# EasyEDA Pro project speedPulser.epro

# Schematic Schematic1
Board Name: Board1; Create Date: 2025-11-09; Page Name: P1; Project Name: SpeedPulserV2; Schematic Name: Schematic1; Update Date: 2025-11-13; Company: EasyEDA.com; Page Size: A4; Version: V1.0
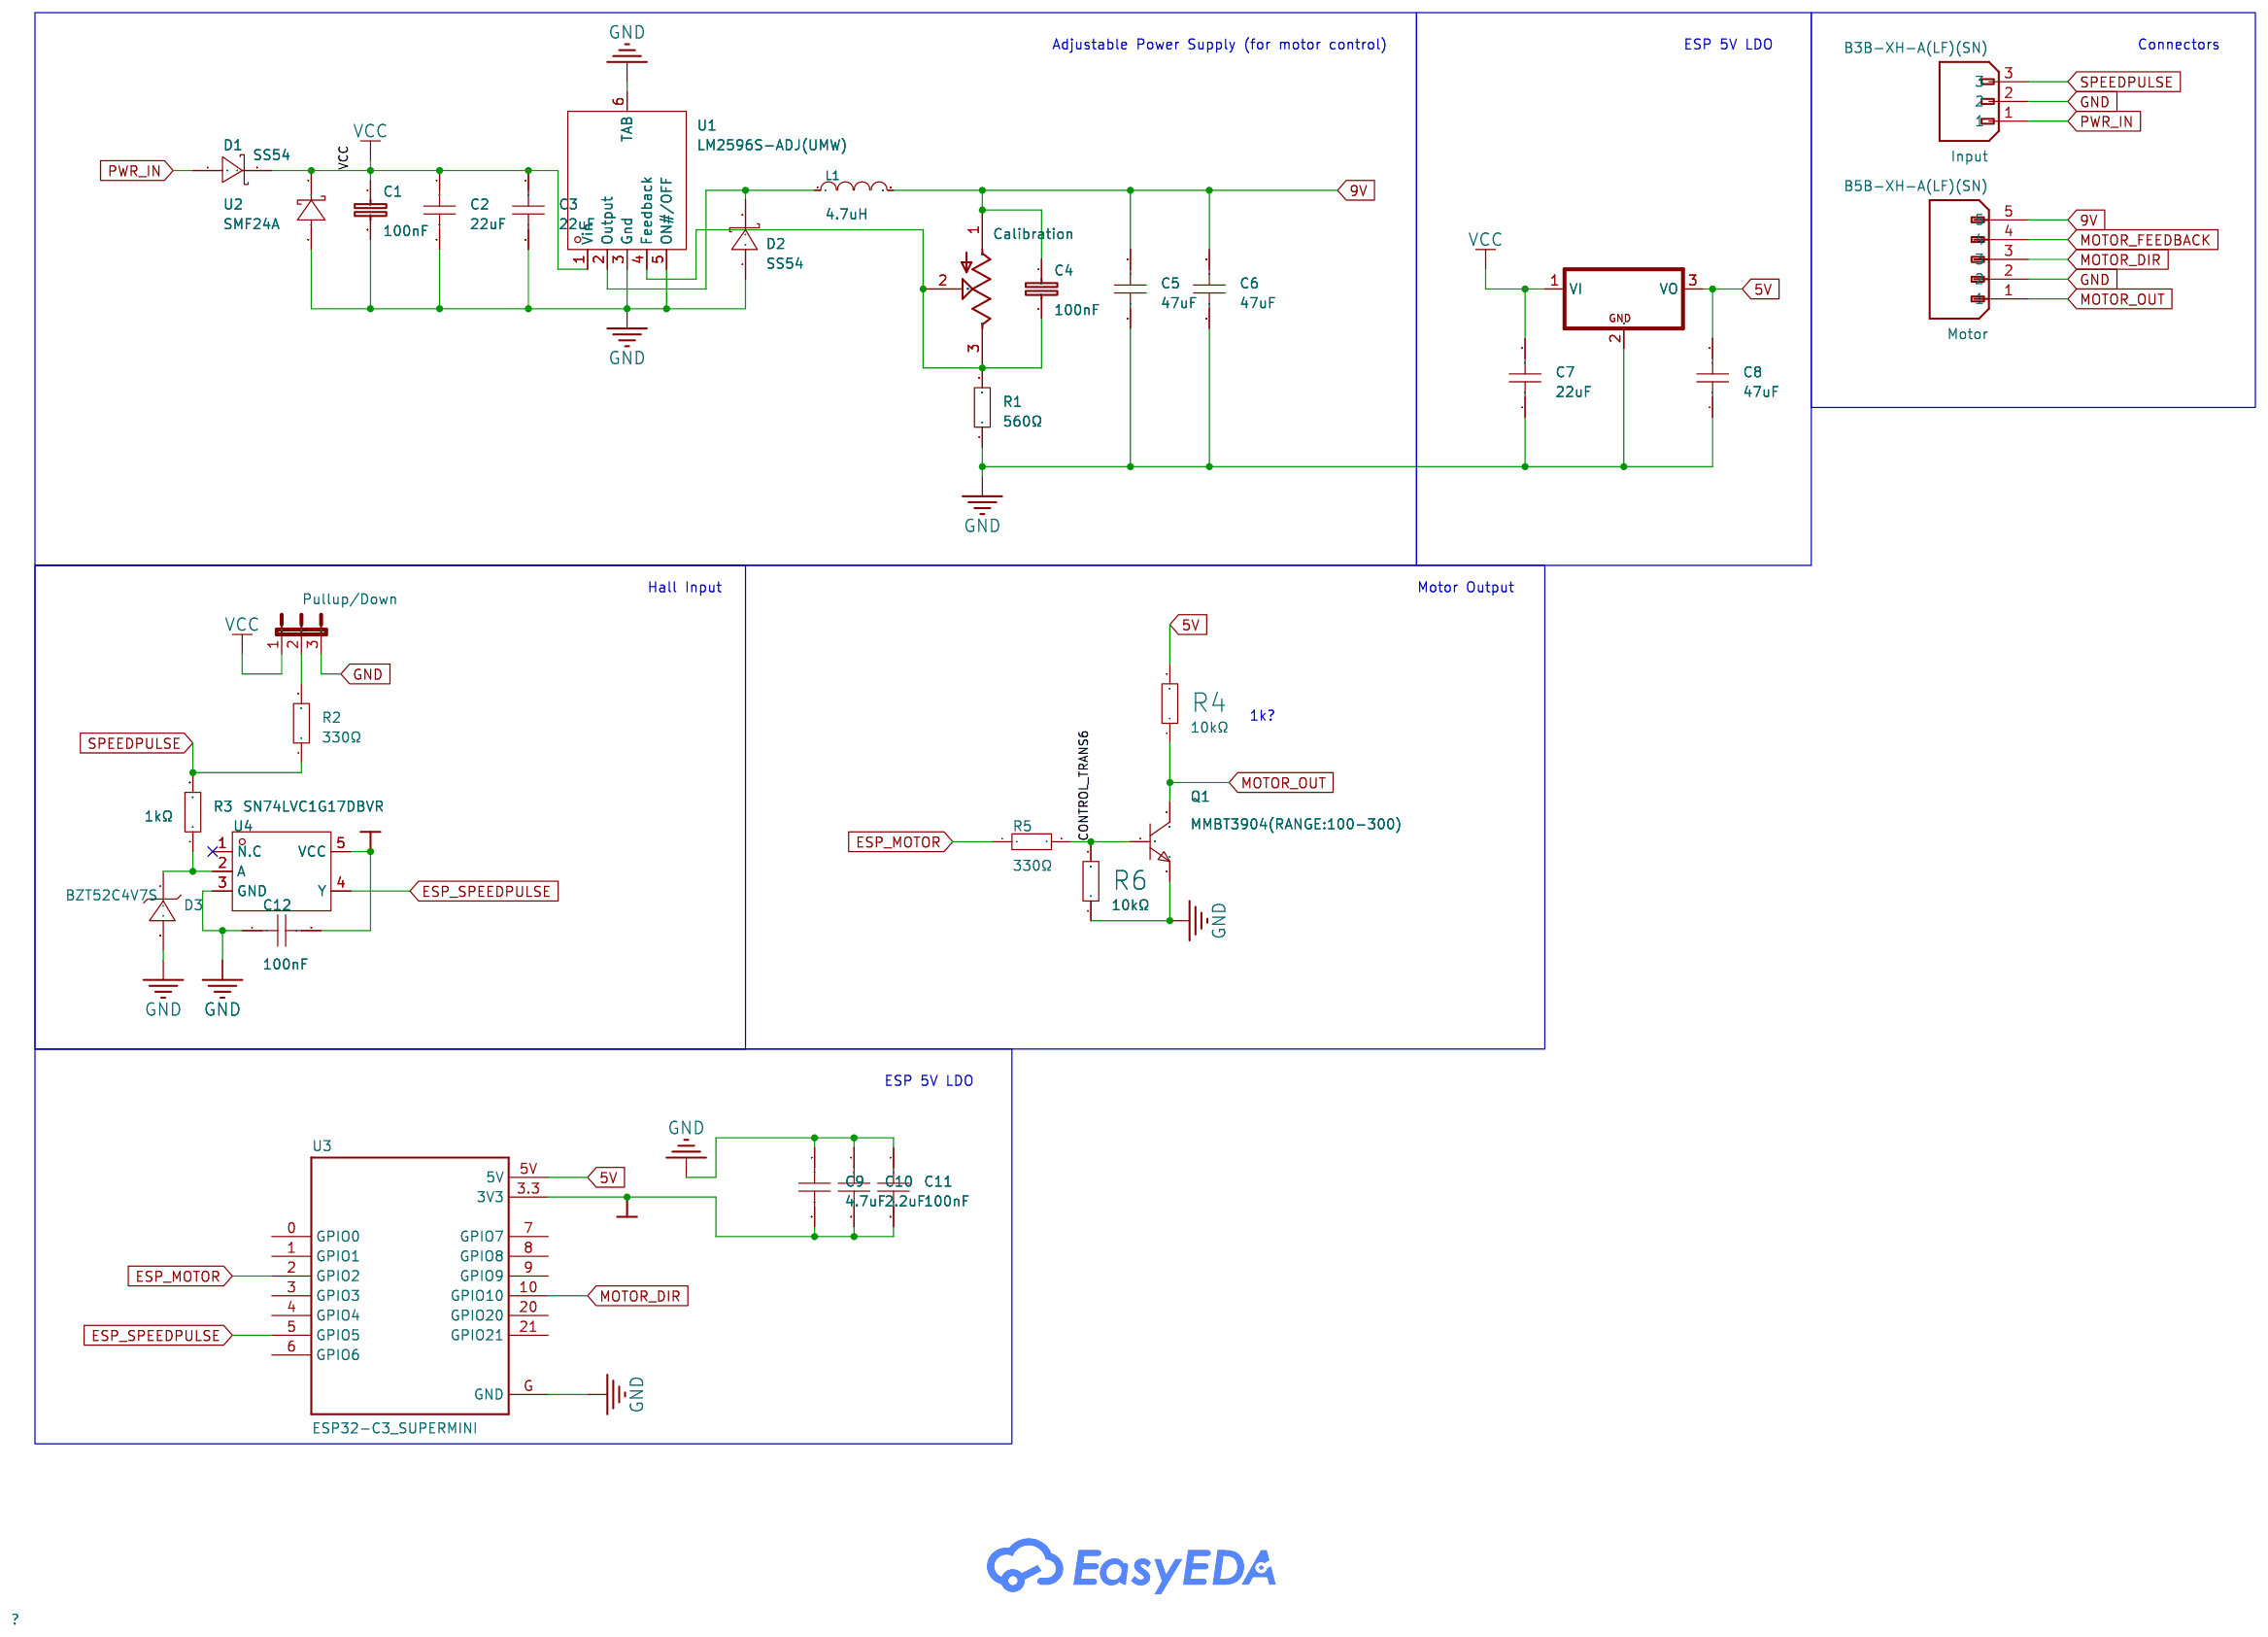
[diagram p0: schematic sheet]

## Parts
C1  100nF  [C0805]
C2  22uF  [C0805]
C3  22uF  [C0805]
C4  100nF  [C0805]
C5  47uF  [C0805]
C6  47uF  [C0805]
C7  22uF  [C0805]
C8  47uF  [C0805]
C9  4.7uF  [C0603]
C10  2.2uF  [C0603]
C11  100nF  [C0603]
C12  100nF  [C0603]
Calibration  10kΩ  [RES-ADJ-TH_3362P]
D1  SS54  [SMA_L4.4-W2.8-LS5.4-R-RD]
D2  SS54  [SMA_L4.4-W2.8-LS5.4-R-RD]
D3  BZT52C4V7S  [SOD-323_L1.8-W1.3-LS2.5-RD]
IC1  L7805ABD2T-TR  [TO-263-2_L10.0-W9.2-P5.08-LS15.3-TL-CW]
Input  B3B-XH-A(LF)(SN)  [CONN-TH_3P-P2.50_A2501WV2-3P]
L1  4.7uH  [IND-SMD_L4.8-W4.5]
Motor  B5B-XH-A(LF)(SN)  [CONN-TH_B5B-XH-A-LF-SN]
Pullup/Down  PZ254V-11-03P  [HDR-TH_3P-P2.54-V-M]
Q1  MMBT3904(RANGE:100-300)  [SOT-23-3_L2.9-W1.3-P1.90-LS2.4-BR]
R1  560Ω  [R0603]
R2  330Ω  [R0603]
R3  1kΩ  [R0603]
R4  10kΩ  [R0603]
R5  330Ω  [R0603]
R6  10kΩ  [R0603]
U1  LM2596S-ADJ(UMW)  [TO-263-5_L10.2-W8.9-P1.70-BR]
U2  SMF24A  [SOD-123FL_L2.8-W1.8-LS3.7-RD-1]
U3  ESP32-C3_SUPERMINI  [MODULE_ESP32-C3_SUPERMINI]
U4  SN74LVC1G17DBVR  [SOT-23-5_L3.0-W1.5-P0.95-LS2.8-BL]

## Library data of the parts
C1 C4 = CT41G-0805-2X1-50V-0.1μF-K(N): Capacitance:100nF Tolerance:±10% Tolerance:±10% Voltage Rating:50V Temperature Coefficient:-; LCSC Part Name: 100nF ±10% 50V; Supplier Part: C126469; Manufacturer: TORCH(火炬); Supplier Footprint: 0805; JLCPCB Part Class: Extended Part; Datasheet: https://atta.szlcsc.com/upload/public/pdf/source/20171225/C150708_15141883600121203188.pdf; Supplier: LCSC; Tolerance: ±10%; Voltage Rating: 50V; Check: true
C2 C3 C7 = HGC0805R5226M350NSLJ: Capacitance: Tolerance:±20% Tolerance:±20% Voltage Rated: Temperature Coefficient:; LCSC Part Name: 22uF ±20% 35V; Supplier Part: C22367832; Manufacturer: Chinocera(华瓷); Supplier Footprint: 0805; JLCPCB Part Class: Extended Part; Datasheet: https://atta.szlcsc.com/upload/public/pdf/source/20240326/E9E9157D170E907C889ABA1F54A94302.pdf; Supplier: LCSC; Tolerance: ±20%; Standardization Check: false
C5 C6 C8 = CL21A476MPYNNWE: Capacitance:47uF Tolerance:±20% Tolerance:±20% Voltage Rating:10V Temperature Coefficient:X5R; LCSC Part Name: 47uF ±20% 10V; Supplier Part: C5596752; Manufacturer: SAMSUNG(三星); Supplier Footprint: 0805; JLCPCB Part Class: Extended Part; Datasheet: https://item.szlcsc.com/datasheet/CL21A476MPYNNWE/6515219.html; Supplier: LCSC; Tolerance: ±20%; Voltage Rating: 10V; Temperature Coefficient: X5R
C9 = CL10A475KP8NNNC: Capacitance:4.7uF Tolerance:±10% Tolerance:±10% Voltage Rating:10V Temperature Coefficient:X5R; LCSC Part Name: 4.7uF ±10% 10V; Supplier Part: C1705; Manufacturer: SAMSUNG(三星); Supplier Footprint: 0603; JLCPCB Part Class: Extended Part; Datasheet: https://item.szlcsc.com/datasheet/CL10A475KP8NNNC/2057.html; Supplier: LCSC; Tolerance: ±10%; Voltage Rating: 10V; Temperature Coefficient: X5R
C10 = CL10A225KO8NNNC: Capacitance:2.2uF Tolerance:±10% Tolerance:±10% Voltage Rating:16V Temperature Coefficient:X5R; LCSC Part Name: 2.2uF ±10% 16V; Supplier Part: C23630; Manufacturer: SAMSUNG(三星); Supplier Footprint: 0603; JLCPCB Part Class: Basic Part; Datasheet: https://item.szlcsc.com/datasheet/CL10A225KO8NNNC/24366.html; Supplier: LCSC; Tolerance: ±10%; Voltage Rating: 16V; Temperature Coefficient: X5R
C11 = CL10B104KB8NNNC: Capacitance:100nF Tolerance:±10% Tolerance:±10% Voltage Rating:50V Temperature Coefficient:X7R; LCSC Part Name: 100nF ±10% 50V; Supplier Part: C1591; Manufacturer: SAMSUNG(三星); Supplier Footprint: 0603; JLCPCB Part Class: Extended Part; Datasheet: https://item.szlcsc.com/datasheet/CL10B104KB8NNNC/1943.html; Supplier: LCSC; Tolerance: ±10%; Voltage Rating: 50V; Temperature Coefficient: X7R
C12 = CC0603KRX7R9BB104: Capacitance:100nF Tolerance:±10% Tolerance:±10% Voltage Rating:50V Temperature Coefficient:X7R; LCSC Part Name: 100nF ±10% 50V; Supplier Part: C14663; Manufacturer: YAGEO(国巨); Supplier Footprint: 0603; JLCPCB Part Class: Basic Part; Datasheet: https://atta.szlcsc.com/upload/public/pdf/source/20250214/096C4C206003071F5D32E5F0D8E7F8DF.pdf; Supplier: LCSC; Tolerance: ±10%; Voltage Rating: 50V; Temperature Coefficient: X7R
Calibration = 3362P-1-103_C118956: Resistance: Tolerance:±10% Tolerance:±10%; LCSC Part Name: 10kΩ ±10%; Supplier Part: C118956; Manufacturer: BOCHEN(博晨); Manufacturer Part: 3362P-1-103; Supplier Footprint: 插件; JLCPCB Part Class: Extended Part; Datasheet: https://atta.szlcsc.com/upload/public/pdf/source/20171114/C118956_15106326650691117445.pdf; Supplier: LCSC; Tolerance: ±10%; Check: true
D1 D2 = SS54_C22452: Diode Configuration:Independent Type Forward Voltage (Vf@If):550mV@5A Reverse Voltage (Vr):40V Rectified Current:5A Reverse Leakage Current (Ir):1mA@40V; LCSC Part Name: 电压:40V 电流:5A; Supplier Part: C22452; Manufacturer: MDD(辰达半导体); Supplier Footprint: SMA(DO-214AC); JLCPCB Part Class: Basic Part; Datasheet: https://atta.szlcsc.com/upload/public/pdf/source/20240710/73DFBB65C1883B895E62D589679033DF.pdf; Supplier: LCSC; Diode Configuration: Independent Type; Forward Voltage (Vf@If): 550mV@5A; Reverse Voltage (Vr): 40V; Rectified Current: 5A; Reverse Leakage Current (Ir): 1mA@40V
D3 = BZT52C4V7S_C353517: Diode Configuration:Independent Zener Voltage(Nom):4.7V Reverse Leakage Current (Ir):3uA@2V Zener Voltage(Range):4.4V~5V Zener Voltage(Range):4.4V~5V Pd - Power Dissipation:200mW Impedance(Zzt):80Ω Operating Junction Temperature Range:-55℃~+150℃ Operating; LCSC Part Name: 独立式 耐压:4.7V 电流:3uA@2V; Supplier Part: C353517; Manufacturer: 晶导微电子; Supplier Footprint: SOD-323; JLCPCB Part Class: Extended Part; Datasheet: https://item.szlcsc.com/datasheet/BZT52C4V7S/329266.html; Supplier: LCSC; Diode Configuration: Independent; Zener Voltage(Nom): 4.7V; Reverse Leakage Current (Ir): 3uA@2V; Zener Voltage(Range): 4.4V~5V; Pd - Power Dissipation: 200mW; Impedance(Zzt): 80Ω; Operating Junction Temperature Range: -55℃~+150℃
IC1 = L7805ABD2T-TR: Output Type:Fixed Maximum Input Voltage:35V Output Voltage:5V Output Voltage:5V Output Current:1.5A Power Supply Rejection Ratio (PSRR):68dB@(120Hz) Dropout Voltage:2V@(1A) standby current:6mA Feature:Short-Circuit  Protection；Thermal Protection(TSD) Oper; LCSC Part Name: 正稳压器IC; Supplier Part: C86206; Manufacturer: ST(意法半导体); Supplier Footprint: TO-263-2; JLCPCB Part Class: Extended Part; Datasheet: https://atta.szlcsc.com/upload/public/pdf/source/20191219/C472632_C0855675BBC73B8C8E44EE1325AAD56A.pdf; Supplier: LCSC; Output Type: Fixed; Maximum Input Voltage: 35V; Output Voltage: 5V; Output Current: 1.5A; Power Supply Rejection Ratio (PSRR): 68dB@(120Hz); Dropout Voltage: 2V@(1A); standby current: 6mA; Feature: Short-Circuit  Protection；Thermal Protection(TSD); Operating Temperature: -40℃~+125℃; Output Polarity: Positive electrode; Number of Outputs: 1; Check: true
Input = B3B-XH-A(LF)(SN): Pins Structure:1x3P Pitch:2.5mm Mounting Style:Direct Insert Reference Series:XH Number of Pins:3P Number of Rows:1 Number of PINs Per Row:3 Row Spacing:- Current Rating (Max):3A Contact Material:Brass Contact Plating:Tin Operating Temperature Range:-25℃~; LCSC Part Name: 1x3P 间距:2.5mm 直插 系列:XH; Supplier Part: C144394; Manufacturer: JST; Supplier Footprint: 插件,P=2.5mm; JLCPCB Part Class: Extended Part; Datasheet: https://atta.szlcsc.com/upload/public/pdf/source/20180928/C265283_F9DFEEBDB2CF642B6BDFAB4B77BD2680.pdf; Supplier: LCSC; Pins Structure: 1x3P; Pitch: 2.5mm; Mounting Style: Direct Insert; Reference Series: XH; Number of Pins: 3P; Number of Rows: 1; Number of PINs Per Row: 3; Current Rating (Max): 3A; Contact Material: Brass; Contact Plating: Tin; Operating Temperature Range: -25℃~+85℃; Rated Voltage (Max): 250V; Plastic Material: PA66; Flame Retardant Rating: UL94V-0; Supplementary Features: K-leg punch; Colour: White; Z-Height of the Board: 7mm; X-Length of Bottom Edge on Board (Spacing Line): 9.9mm; Y-Width of Bottom Edge on Board: 5.75mm
L1 = SMMS0420-4R7M: Inductance: Tolerance:±20% Tolerance:±20% Rated Current: Saturation Current (Isat):3A DC Resistance (DCR): Type:一体成型电感; LCSC Part Name: 4.7uH ±20% 3A; Supplier Part: C133193; Manufacturer: SXN(顺翔诺); Supplier Footprint: SMD; JLCPCB Part Class: Extended Part; Datasheet: https://atta.szlcsc.com/upload/public/pdf/source/20210810/BBF24330FB2F5029F637830BA9C42C0D.pdf; Supplier: LCSC; Tolerance: ±20%; Saturation Current (Isat): 3A; Type: 一体成型电感; Check: true
Motor = B5B-XH-A(LF)(SN): Pins Structure:1x5P Pitch:2.5mm Mounting Style:Direct Insert Reference Series:XH Number of Pins:5P Number of Rows:1 Number of PINs Per Row:5 Row Spacing:- Current Rating (Max):3A Contact Material:Brass Contact Plating:Tin Operating Temperature Range:-25℃~; LCSC Part Name: 1x5P 间距:2.5mm 直插 系列:XH; Supplier Part: C157991; Manufacturer: JST; Supplier Footprint: 插件,P=2.5mm; JLCPCB Part Class: Extended Part; Datasheet: https://atta.szlcsc.com/upload/public/pdf/source/20180928/C265283_F9DFEEBDB2CF642B6BDFAB4B77BD2680.pdf; Supplier: LCSC; Pins Structure: 1x5P; Pitch: 2.5mm; Mounting Style: Direct Insert; Reference Series: XH; Number of Pins: 5P; Number of Rows: 1; Number of PINs Per Row: 5; Current Rating (Max): 3A; Contact Material: Brass; Contact Plating: Tin; Operating Temperature Range: -25℃~+85℃; Rated Voltage (Max): 250V; Plastic Material: PA66; Flame Retardant Rating: UL94V-0; Supplementary Features: K-leg punch; Colour: White; Z-Height of the Board: 7mm; X-Length of Bottom Edge on Board (Spacing Line): 14.9mm; Y-Width of Bottom Edge on Board: 5.75mm
Pullup/Down = PZ254V-11-03P: Pin Structure:1x3P Pitch:2.54mm Row Spacing:- Circluar Pins/Square Pins:Policy Mounting Type:Straight Number of Rows:Single Row Number of Pins:3P Current Rating:3A Voltage Rating (Max):250V Length of Mating Pin:6mm Insulation Height:2.5mm Length of End Co; LCSC Part Name: 1x3P 间距:2.54mm 方针 直插; Supplier Part: C2937625; Manufacturer: XFCN(兴飞); Supplier Footprint: 插件,P=2.54mm; JLCPCB Part Class: Extended Part; Datasheet: https://atta.szlcsc.com/upload/public/pdf/source/20200309/C492402_8335C3D49C4E4C618838D59BB1D024C1.pdf; Supplier: LCSC; Pin Structure: 1x3P; Pitch: 2.54mm; Circluar Pins/Square Pins: Policy; Mounting Type: Straight; Number of Rows: Single Row; Number of Pins: 3P; Current Rating: 3A; Voltage Rating (Max): 250V; Length of Mating Pin: 6mm; Insulation Height: 2.5mm; Length of End Connection Pin: 3mm; Operating Temperature: -40℃~+105℃; Color: Black; Check: true
Q1 = MMBT3904(RANGE:100-300): type:NPN Current - Collector(Ic): Collector - Emitter Voltage VCEO:40V Pd - Power Dissipation:200mW DC Current Gain:100@10mA,1V DC Current Gain:100@10mA,1V Transition frequency(fT):300MHz Current - Collector Cutoff:100nA Vce Saturation(VCE(sat)):300mV Ope; LCSC Part Name: hfe=100~300; Supplier Part: C20526; Manufacturer: CJ(江苏长电/长晶); Supplier Footprint: SOT-23; JLCPCB Part Class: Basic Part; Datasheet: https://atta.szlcsc.com/upload/public/pdf/source/20220704/70F575FB75061E03F919270A6BB8BA7F.pdf; Supplier: LCSC; type: NPN; Collector - Emitter Voltage VCEO: 40V; Pd - Power Dissipation: 200mW; DC Current Gain: 100@10mA,1V; Transition frequency(fT): 300MHz; Current - Collector Cutoff: 100nA; Vce Saturation(VCE(sat)): 300mV; Check: true
R1 = 0603WAF5600T5E: Type:Thick Film Resistors Resistance: Tolerance:±1% Tolerance:±1% Power(Watts): Overload Voltage (Max): Temperature Coefficient:±100ppm/℃ Temperature Coefficient:±100ppm/℃ Operating Temperature Range:-55℃~+155℃ Operating Temperature Range:-55℃~+155℃; LCSC Part Name: 560Ω ±1% 100mW 厚膜电阻; Supplier Part: C23204; Manufacturer: UNI-ROYAL(厚声); Supplier Footprint: 0603; JLCPCB Part Class: Basic Part; Datasheet: https://atta.szlcsc.com/upload/public/pdf/source/20200306/C422600_1E6D84923E4A46A82E41ADD87F860B5C.pdf; Supplier: LCSC; Type: Thick Film Resistors; Tolerance: ±1%; Temperature Coefficient: ±100ppm/℃; Operating Temperature Range: -55℃~+155℃; Check: true
R2 R5 = 0603WAF3300T5E: Type:Thick Film Resistors Resistance: Tolerance:±1% Tolerance:±1% Power(Watts): Overload Voltage (Max): Temperature Coefficient:±100ppm/℃ Temperature Coefficient:±100ppm/℃ Operating Temperature Range:-55℃~+155℃ Operating Temperature Range:-55℃~+155℃; LCSC Part Name: 330Ω ±1% 100mW 厚膜电阻; Supplier Part: C23138; Manufacturer: UNI-ROYAL(厚声); Supplier Footprint: 0603; JLCPCB Part Class: Basic Part; Datasheet: https://atta.szlcsc.com/upload/public/pdf/source/20200306/C422600_1E6D84923E4A46A82E41ADD87F860B5C.pdf; Supplier: LCSC; Type: Thick Film Resistors; Tolerance: ±1%; Temperature Coefficient: ±100ppm/℃; Operating Temperature Range: -55℃~+155℃; Check: true
R3 = 0603WAF1001T5E: Type:Thick Film Resistors Resistance:1kΩ Tolerance:±1% Tolerance:±1% Power(Watts): Overload Voltage (Max): Temperature Coefficient:±100ppm/℃ Temperature Coefficient:±100ppm/℃ Operating Temperature Range:-55℃~+155℃ Operating Temperature Range:-55℃~+155℃; LCSC Part Name: 1kΩ ±1% 100mW 厚膜电阻; Supplier Part: C21190; Manufacturer: UNI-ROYAL(厚声); Supplier Footprint: 0603; JLCPCB Part Class: Basic Part; Datasheet: https://atta.szlcsc.com/upload/public/pdf/source/20200306/C422600_1E6D84923E4A46A82E41ADD87F860B5C.pdf; Supplier: LCSC; Type: Thick Film Resistors; Tolerance: ±1%; Temperature Coefficient: ±100ppm/℃; Operating Temperature Range: -55℃~+155℃; Check: true
R4 R6 = 0603WAF1002T5E: Type:Thick Film Resistor Resistance:10kΩ Tolerance:±1% Tolerance:±1% Power(Watts):100mW Voltage-Supply(Max):75V Temperature Coefficient:±100ppm/℃ Temperature Coefficient:±100ppm/℃ Operating Temperature:-55℃~+155℃ Operating Temperature:-55℃~+155℃; LCSC Part Name: 厚膜电阻 10kΩ ±1% 100mW; Supplier Part: C25804; Manufacturer: UNI-ROYAL(厚声); Supplier Footprint: 0603; JLCPCB Part Class: Basic Part; Datasheet: https://atta.szlcsc.com/upload/public/pdf/source/20200306/C422600_1E6D84923E4A46A82E41ADD87F860B5C.pdf; Supplier: LCSC; Type: Thick Film Resistor; Tolerance: ±1%; Power(Watts): 100mW; Voltage-Supply(Max): 75V; Temperature Coefficient: ±100ppm/℃; Operating Temperature: -55℃~+155℃; Check: true
U1 = LM2596S-ADJ(UMW): Function:Step-down type Output Type:Adjustable Input Voltage:40V Input Voltage:40V Output Voltage:1.2V~37V Output Voltage:1.2V~37V Output Current:3A Switching Frequency:150kHz Switching Frequency:150kHz Operating Temperature:-40℃~+125℃@(TA) Operating Temp; LCSC Part Name: 3A降压稳压器; Supplier Part: C347423; Manufacturer: UMW(友台半导体); Supplier Footprint: TO-263-5; JLCPCB Part Class: Extended Part; Datasheet: https://atta.szlcsc.com/upload/public/pdf/source/20241113/7515F50B4FEE0270D4DE7078364C87FA.pdf; Supplier: LCSC; Function: Step-down type; Output Type: Adjustable; Input Voltage: 40V; Output Voltage: 1.2V~37V; Output Current: 3A; Switching Frequency: 150kHz; Operating Temperature: -40℃~+125℃@(TA); Synchronous Rectification: No; Number of Outputs: 1; Topology: Step-down; Quiescent Current (Iq): 80uA; Switch tube (built-in/external): Built-in; Check: true
U2 = SMF24A_C7495269: Polarity:Unidirectional Reverse Stand-Off Voltage (Vrwm):24V Clamping Voltage:38.9V Peak Pulse Current (Ipp):5.1A Peak Pulse Power Dissipation (Ppp):200W Voltage - Breakdown:26.7V；29.5V Reverse Leakage Current (Ir):1uA Operating Temperature:-65℃~+150℃ Ope; LCSC Part Name: 单向TVS 24V截止 峰值浪涌电流：5.1A; Supplier Part: C7495269; Manufacturer: HXY MOSFET(华轩阳电子); Supplier Footprint: SOD-123FL; JLCPCB Part Class: Extended Part; Datasheet: https://item.szlcsc.com/datasheet/SMF24A/8559487.html; Supplier: LCSC; Polarity: Unidirectional; Reverse Stand-Off Voltage (Vrwm): 24V; Clamping Voltage: 38.9V; Peak Pulse Current (Ipp): 5.1A; Peak Pulse Power Dissipation (Ppp): 200W; Voltage - Breakdown: 26.7V；29.5V; Reverse Leakage Current (Ir): 1uA; Operating Temperature: -65℃~+150℃; Type: TVS
U3 = ESP32-C3_SUPERMINI_ESP32-C3_SUPERMINI_: AVAILABILITY: Not in stock; CHECK_PRICES: https://www.snapeda.com/parts/ESP32-C3%20SuperMini/Espressif+Systems/view-part/?ref=eda; MF: Espressif Systems; MP: ESP32-C3 SuperMini; Package1: Package; PRICE: None; SNAPEDA_LINK: https://www.snapeda.com/parts/ESP32-C3%20SuperMini/Espressif+Systems/view-part/?ref=snap
U4 = SN74LVC1G17DBVR_C19829662: Supplier Part: C19829662; Manufacturer: TECH PUBLIC(台舟); Supplier Footprint: SOT-23-5; JLCPCB Part Class: Extended Part; Datasheet: https://atta.szlcsc.com/upload/public/pdf/source/20240202/EAF8B4F29332307745EEFE11873F995E.pdf; Supplier: LCSC

## Nets
3V3: C9.2 C10.2 C11.2 C12.2 U3.3.3(3V3) U4.5(VCC)
5V: C8.2 IC1.3(VO) R4.2 U3.5V
9V: C4.1 C5.2 C6.2 Calibration.1(CCW) L1.2 Motor.5
GND: C1.2 C2.2 C3.2 C5.1 C6.1 C7.1 C8.1 C9.1 C10.1 C11.1 C12.1 D2.1(A) D3.2(A) IC1.2(GND) Input.2 Motor.2 Pullup/Down.3 Q1.2(E) R1.1 R6.1 U1.3(Gnd) U1.5(ON#/OFF) U1.6(TAB) U2.2(A) U3.G(GND) U4.3(GND)
VCC: C1.1 C2.1 C3.1 C7.2 D1.2(K) IC1.1(VI) Pullup/Down.1 U1.1(Vin) U2.1(K)
CONTROL_TRANS6: Q1.1(B) R5.2 R6.2
ESP_MOTOR: R5.1 U3.2(GPIO2)
ESP_SPEEDPULSE: U3.5(GPIO5) U4.4(Y)
MOTOR_DIR: Motor.3 U3.10(GPIO10)
MOTOR_FEEDBACK: Motor.4
MOTOR_OUT: Motor.1 Q1.3(C) R4.1
PWR_IN: D1.1(A) Input.1
SPEEDPULSE: Input.3 R2.1 R3.2
$1N4263: C4.2 Calibration.2(WIPER) Calibration.3(CW) R1.2 U1.4(Feedback)
$1N4276: D2.2(K) L1.1 U1.2(Output)
$1N4300: Pullup/Down.2 R2.2
$1N4302: D3.1(K) R3.1 U4.2(A)

Not connected (* = marked no-connect by the designer): U3 0(GPIO0) 1(GPIO1) 3(GPIO3) 4(GPIO4) 6(GPIO6) 7(GPIO7) 8(GPIO8) 9(GPIO9) 20(GPIO20) 21(GPIO21); U4 1(N.C)*

## Notes on the sheet
- Adjustable Power Supply (for motor control)
- ESP 5V LDO
- Connectors
- Hall Input
- Motor Output
- 1k?
- ESP 5V LDO

# Board PCB1
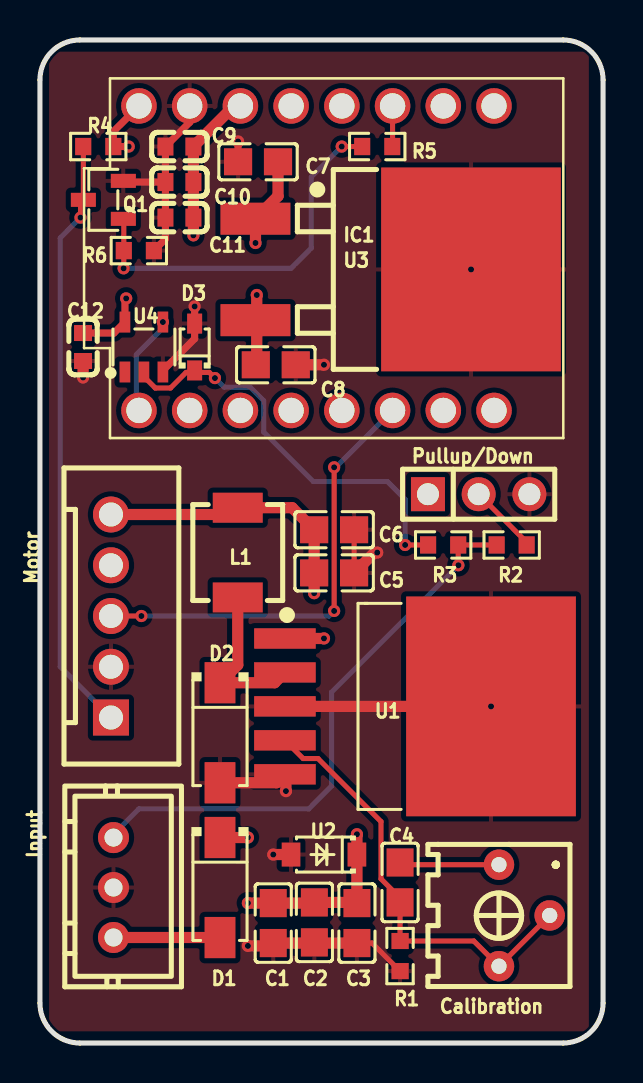
[diagram p1: board, top side]
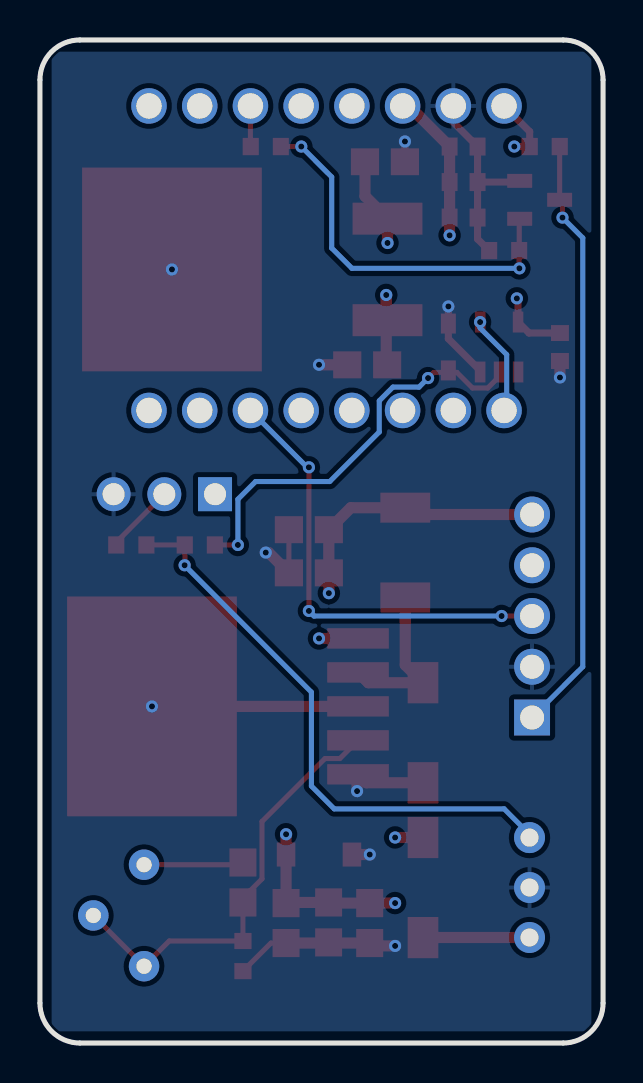
[diagram p2: board, bottom side, seen from below]

Outline 28.2 x 50.2 mm; copper layers: Top Layer, PWR, GND, Bottom Layer. Coordinates in mm from the lower left corner of the outline.
Outline path: 0,48.2 0,2 arc(0.59,0.59) 2,0 26.2,0 arc(27.61,0.59) 28.2,2 28.2,48.2 arc(27.61,49.61) 26.2,50.2 2,50.2 arc(0.59,49.61) 0,48.2
Stack: Top Layer 0.035mm Outer layer thickness 1oz / Dielectric1 0.2104mm 7628 RC49% 8.6mil / PWR 0.0152mm Inner layer thickness / Dielectric2 1.065mm 1.1mm H/HOZ Copper / GND 0.0152mm Inner layer thickness / Dielectric3 0.2104mm 7628 RC49% 8.6mil / Bottom Layer 0.035mm Outer layer thickness 1oz

## Design rules (mm)
template: JLCPCB Capability(Two Layers Board)
spacing copperThickness1oz (default): track to track 0.102, other pairs 0.152 to 0.3
spacing copperThickness2oz: track to track 0.203, other pairs 0.152 to 0.3
track width copperThickness1oz (default): min 0.127, default 0.254, max 2.54
track width copperThickness2oz: min 0.203, default 0.254, max 2.54
differential pair differentialPair (default): width min 0.127, default 0.254, max 2.54; gap min 0.152, default 0.152
via viaSize (default): diameter min 0.5, default 0.61, max 10; hole min 0.3, default 0.305, max 6.3

## Placement (name value [footprint] x y rotation side)
C1  100nF  [C0805]  11.68 6 270 top
C2  22uF  [C0805]  13.74 6.04 270 top
C3  22uF  [C0805]  15.88 6 270 top
C4  100nF  [C0805]  18.03 8.04 270 top
C5  47uF  [C0805]  14.73 23.53 180 top
C6  47uF  [C0805]  14.73 25.69 180 top
C7  22uF  [C0805]  10.92 44.1 0 top
C8  47uF  [C0805]  11.81 33.94 180 top
C9  4.7uF  [C0603]  6.98 44.87 0 top
C10  2.2uF  [C0603]  6.98 43.09 0 top
C11  100nF  [C0603]  6.98 41.31 0 top
C12  100nF  [C0603]  2.16 34.83 90 top
Calibration  10kΩ  [RES-ADJ-TH_3362P]  24.26 6.38 270 top
D1  SS54  [SMA_L4.4-W2.8-LS5.4-R-RD]  9.02 7.78 270 top
D2  SS54  [SMA_L4.4-W2.8-LS5.4-R-RD]  9.02 15.53 270 top
D3  BZT52C4V7S  [SOD-323_L1.8-W1.3-LS2.5-RD]  7.75 34.83 90 top
IC1  L7805ABD2T-TR  [TO-263-2_L10.0-W9.2-P5.08-LS15.3-TL-CW]  16.19 38.72 0 top
Input  B3B-XH-A(LF)(SN)  [CONN-TH_3P-P2.50_A2501WV2-3P]  3.68 7.78 90 top
L1  4.7uH  [IND-SMD_L4.8-W4.5]  9.91 24.55 90 top
Motor  B5B-XH-A(LF)(SN)  [CONN-TH_B5B-XH-A-LF-SN]  3.56 21.37 270 top
Pullup/Down  PZ254V-11-03P  [HDR-TH_3P-P2.54-V-M]  21.97 27.47 0 top
Q1  MMBT3904(RANGE:100-300)  [SOT-23-3_L2.9-W1.3-P1.90-LS2.4-BR]  3.17 42.2 0 top
R1  560Ω  [R0603]  18.03 4.35 90 top
R2  330Ω  [R0603]  23.62 24.93 0 top
R3  1kΩ  [R0603]  20.19 24.93 0 top
R4  10kΩ  [R0603]  2.92 44.87 0 top
R5  330Ω  [R0603]  16.89 44.87 180 top
R6  10kΩ  [R0603]  4.95 39.66 180 top
U1  LM2596S-ADJ(UMW)  [TO-263-5_L10.2-W8.9-P1.70-BR]  17.43 16.85 180 top
U2  SMF24A  [SOD-123FL_L2.8-W1.8-LS3.7-RD-1]  14.22 9.43 180 top
U3  ESP32-C3_SUPERMINI  [MODULE_ESP32-C3_SUPERMINI]  14.86 39.28 90 top
U4  SN74LVC1G17DBVR  [SOT-23-5_L3.0-W1.5-P0.95-LS2.8-BL]  5.21 34.83 0 top

## Footprints (pads in the part's own frame, mm; a bottom-side part is the same pattern mirrored in y, then rotated)
C0603
  rect 0.8x0.9 smd: 1(-0.7,0) 2(0.7,0)
C0805
  rect 1.41x1.35 smd: 1(-1,0) 2(1,0)
CONN-TH_3P-P2.50_A2501WV2-3P
  round 1.55 hole 0.9: 1(-2.5,0) 2(0,0) 3(2.5,0)
CONN-TH_B5B-XH-A-LF-SN
  rect 1.8x1.8 hole 1.2: 1(5.08,0)
  round 1.8 hole 1.2: 2(2.54,0) 3(0,0) 4(-2.54,0) 5(-5.08,0)
HDR-TH_3P-P2.54-V-M
  rect 1.7x1.7 hole 1.1: 1(-2.54,0)
  round 1.7 hole 1.1: 2(0,0) 3(2.54,0)
IND-SMD_L4.8-W4.5
  rect 1.5x2.5 smd: 1(-2.245,0) 2(2.245,0)
MODULE_ESP32-C3_SUPERMINI
  round 1.778 hole 1.27: 0(7.62,-7.88) 1(7.62,-5.34) 2(7.62,-2.8) 3(7.62,-0.26) 3.3(7.62,4.82) 4(7.62,2.28) 5(-7.62,9.9) 5V(7.62,9.9) 6(-7.62,7.36) 7(-7.62,4.82) 8(-7.62,2.28) 9(-7.62,-0.26) 10(-7.62,-2.8) 20(-7.62,-5.34) 21(-7.62,-7.88) G(7.62,7.36)
R0603
  rect 0.806x0.864 smd: 1(-0.753,0) 2(0.753,0)
RES-ADJ-TH_3362P
  round 1.524 hole 0.762: 1(-2.54,-1.27) 2(0,1.27) 3(2.54,-1.27)
SMA_L4.4-W2.8-LS5.4-R-RD
  rect 2.062x1.539 smd: 1(2.503,0) 2(-2.503,0)
SOD-123FL_L2.8-W1.8-LS3.7-RD-1
  rect 0.93x1.2 smd: 1(-1.65,0) 2(1.65,0)
SOD-323_L1.8-W1.3-LS2.5-RD
  rect 1x0.75 smd: 1(-1.173,0) 2(1.173,0)
SOT-23-3_L2.9-W1.3-P1.90-LS2.4-BR
  rect 1.25x0.7 smd: 1(1,-0.95) 2(1,0.95) 3(-1,0)
SOT-23-5_L3.0-W1.5-P0.95-LS2.8-BL
  rect 0.532x1.045 smd: 1(-0.95,-1.25) 2(0,-1.25) 3(0.95,-1.25) 4(0.95,1.25) 5(-0.95,1.25)
TO-263-2_L10.0-W9.2-P5.08-LS15.3-TL-CW
  rect 3.5x1.6 smd: 1(-5.397,2.54) 3(-5.397,-2.54)
  rect 9x10.2 smd: 2(5.397,0)
TO-263-5_L10.2-W8.9-P1.70-BR
  rect 3.083x1.02 smd: 1(5.16,-3.4) 2(5.16,-1.7) 3(5.16,0) 4(5.16,1.7) 5(5.16,3.4)
  rect 8.5x11 smd: 6(-5.16,0)

## Nets
As in the schematic.

Pads without a net: U3 0 1 3 4 6 7 8 9 20 21; U4 1

## Via types
v1: diameter 0.61, hole 0.305, Top Layer to Bottom Layer, 30 vias

## Routing (per net, layer and track width the routed paths; a pad name or vN(x,y) marks a point on that pad's centre or on a via; arc(x,y) is an arc through that point)
3V3: length 16.7
  Top Layer w0.355: C12.2 3.71,35.53 U4.5 4.26,37.2 v1(4.32,37.27)
  Top Layer w0.559: U3.3.3 9.72,46.9 C9.2 C10.2 C11.2 v1(7.69,40.42)
  PWR w0.355: v1(7.69,40.42) 6.86,39.59 6.86,38.13 5.99,37.27 v1(4.32,37.27)
5V: length 18.8
  Top Layer w0.355: v1(4.44,44.87) R4.2 3.67,45.61 U3.5V
  Top Layer w0.559: C8.2 10.86,33.99 v1(10.86,37.44)
  PWR w0.355: v1(4.44,44.87) 5.33,43.98 8.51,43.98 8.86,43.62 8.86,39.43 v1(10.86,37.44)
9V: length 37.6
  Top Layer w0.254: 22.99,8.92 18.14,8.92 C4.1
  Top Layer w0.559: 3.56,26.45 9.57,26.45 L1.2 12.63,26.79 C6.2 C5.2 v1(13.73,22.51)
  PWR w0.254: v1(13.73,22.51) 15.75,22.51 22.99,15.27 22.99,8.92
GND: length 44.8
  Top Layer w0.254: C3.2 16.63,5 R1.1 ; C6.1 C5.1
  Top Layer w0.355: C10.1 C11.1 6.28,40.24 R6.1 ; C10.1 4.24,43.09 Q1.2 ; C10.1 C9.1 7.5,46.08 U3.G ; v1(7.75,36.86) D3.2 7.75,35.25 6.16,33.66 U4.3 ; C7.1 v1(9.92,45.12)
  Top Layer w0.559: C12.1 v1(2.16,33.31) ; v1(12.32,12.61) 12.32,13.4 U1.5 11.85,13.03 D2.1 ; v1(10.41,4.86) 11.54,4.86 C1.2 13.71,5 C2.2 13.78,5 C3.2 ; U2.2 v1(11.68,9.43) ; v1(16.89,24.55) 16.75,24.55 C5.1 ; U1.3 v1(22.59,16.85) ; v1(14.22,33.94) C8.1
  vias: v1(21.59,38.72)
VCC: length 16.8
  Top Layer w0.559: v1(10.79,40.04) IC1.1 11.92,42.38 C7.2 ; v1(10.41,7) C1.1 13.71,7 C2.1 15.84,7.04 15.87,7 U2.1 v1(15.87,10.45) ; D1.2 v1(10.41,10.29) ; U1.1 v1(14.22,20.25)
CONTROL_TRANS6: length 19
  Top Layer w0.254: R5.2 v1(15.11,44.87) ; Q1.1 4.2,41.22 R6.2 4.2,38.78 v1(4.19,38.77)
  Bottom Layer w0.254: v1(15.11,44.87) 13.59,43.34 13.59,39.79 12.57,38.77 v1(4.19,38.77)
ESP_MOTOR: length 2
  Top Layer w0.254: R5.1 17.66,44.88 U3.2
ESP_SPEEDPULSE: length 5
  Bottom Layer w0.254: v1(6.16,36.08) 6.16,35.78 4.83,34.45 4.83,31.79 U3.5
MOTOR_DIR: length 22.6
  Top Layer w0.254: Motor.3 v1(5.08,21.37) ; v1(14.73,21.62) v1(14.73,28.81)
  Bottom Layer w0.254: v1(14.73,21.62) 14.48,21.37 v1(5.08,21.37) ; v1(14.73,28.81) 14.81,28.81 U3.10
MOTOR_OUT: length 30.1
  Top Layer w0.254: v1(2.03,41.31) 2.03,42.06 Q1.3 2.17,44.86 R4.1
  Bottom Layer w0.254: v1(2.03,41.31) 1.02,40.29 1.02,18.83 Motor.1
PWR_IN: length 5.3
  Top Layer w0.559: D1.1 9.01,5.28 Input.1
SPEEDPULSE: length 28.7
  Top Layer w0.254: R2.1 R3.2 20.95,23.92 v1(20.95,23.91)
  Bottom Layer w0.254: v1(20.95,23.91) 14.6,17.56 14.6,12.86 13.46,11.72 4.95,11.72 3.68,10.45 Input.3
$1N4263: length 21.9
  Top Layer w0.254: U1.4 13.18,14.24 13.93,14.24 17.08,11.08 17.08,8.22 18.03,7.26 C4.2 R1.2 21.73,5.11 Calibration.3 Calibration.2
$1N4276: length 8.1
  Top Layer w0.559: U1.2 11.75,18.03 D2.2 9.91,18.92 L1.1
$1N4300: length 3.5
  Top Layer w0.254: R2.2 24.38,25.06 Pullup/Down.2
$1N4302: length 20.9
  Top Layer w0.254: U4.2 5.21,33.35 5.78,32.78 6.54,32.78 7.32,33.56 8.48,33.56 v1(8.76,33.28) ; v1(18.29,24.93) R3.1
  Bottom Layer w0.254: v1(8.76,33.28) 9.22,32.83 10.52,32.83 11.21,32.14 11.21,30.58 13.69,28.1 17.4,28.1 18.29,27.21 v1(18.29,24.93)

## Copper pours and planes (outline as drawn; the poured copper is in the pictures)
GND on Top Layer: 0.46,49.61 27.49,49.61 27.49,0.59 0.46,0.59
GND on Bottom Layer: 0.59,49.61 27.61,49.61 27.61,0.59 0.59,0.59
GND on GND: 0.59,49.61 27.61,49.61 27.61,0.59 0.59,0.59
VCC on PWR: 0.59,49.61 27.61,49.61 27.61,0.59 0.59,0.59
